# Altium schematic sheet Debug connector.SchDoc: Debug connector
size A4; Date: Not used; ApprovedBy: Not used; CheckedBy: Not used; Author: Not used; CompanyName: STMicroelectronics; DrawnBy: Not used; Engineer: Not used; Organization: Not used; Address1: Not used; Address2: Not used; Address3: Not used; Address4: Not used; DocumentNumber: Not used; Revision: Not used; SheetNumber: 18; SheetTotal: 22; CurrentTime: Not used; CurrentDate: Not used; Time: Not used; DocumentFullPathAndName: Not used; DocumentName: Not used; ModifiedDate: Not used; ImagePath: Not used; ProjectName: Not used; Application_BuildNumber: Not used
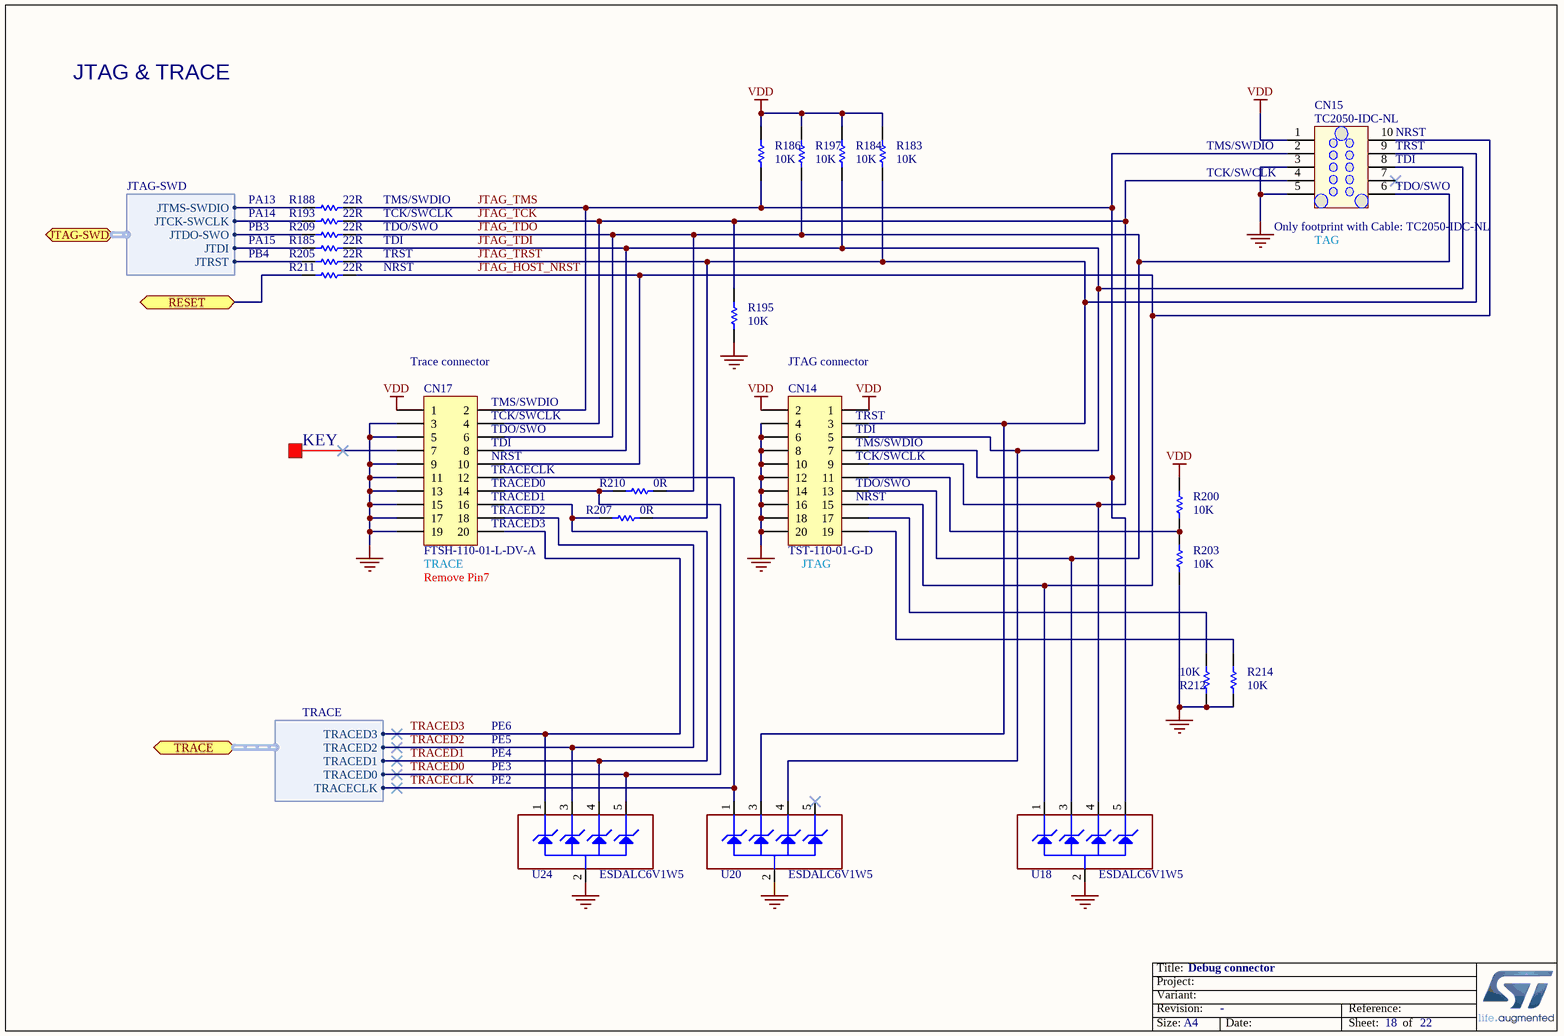
[diagram p0: Debug connector.SchDoc]

## Parts
CN14  value TST-110-01-G-D  [CON_CVILUX_CH87-20-2-V-1-00]  (hidden comment: Header 10x2)
CN15  value TC2050-IDC-NL  [CON_TAG-C_TC2050-IDC-NL]  (hidden comment: Tag-10-C)
CN17  value FTSH-110-01-L-DV-A  [CON_SAMTEC_FTSH-110-01-L-DV-A]  (hidden comment: Header 10x2)
R183  value 10K  [R0402]  (hidden comment: Resistor)
R184  value 10K  [R0402]  (hidden comment: Resistor)
R185  value 22R  [R0402]  (hidden comment: Resistor)
R186  value 10K  [R0402]  (hidden comment: Resistor)
R188  value 22R  [R0402]  (hidden comment: Resistor)
R193  value 22R  [R0402]  (hidden comment: Resistor)
R195  value 10K  [R0402]  (hidden comment: Resistor)
R197  value 10K  [R0402]  (hidden comment: Resistor)
R200  value 10K  [R0402]  (hidden comment: Resistor)
R203  value 10K  [R0402]  (hidden comment: Resistor)
R205  value 22R  [R0402]  (hidden comment: Resistor)
R207  value 0R  [R0402]  (hidden comment: Resistor)
R209  value 22R  [R0402]  (hidden comment: Resistor)
R210  value 0R  [R0402]  (hidden comment: Resistor)
R211  value 22R  [R0402]  (hidden comment: Resistor)
R212  value 10K  [R0402]  (hidden comment: Resistor)
R214  value 10K  [R0402]  (hidden comment: Resistor)
U18  ESDALC6V1W5  [ESD_SOT323-5L]
U20  ESDALC6V1W5  [ESD_SOT323-5L]
U24  ESDALC6V1W5  [ESD_SOT323-5L]

## Ports
JTAG-SWD (harness JTAG-SWD), RESET, TRACE (harness TRACE)

## Harnesses
TRACE: TRACECLK, TRACED0, TRACED1, TRACED2, TRACED3
JTAG-SWD: JTMS-SWDIO, JTCK-SWCLK, JTDI, JTDO-SWO, JTRST

## Nets
GND: CN14.4 CN14.6 CN14.8 CN14.10 CN14.12 CN14.14 CN14.16 CN14.18 CN14.20 CN15.3 CN15.5 CN17.3 CN17.5 CN17.9 CN17.11 CN17.13 CN17.15 CN17.17 CN17.19 R195.1 R203.1 R212.1 R214.1 U18.2(GND) U20.2(GND) U24.2(GND)
VDD: CN14.1 CN14.2 CN15.1 CN17.1 R183.2 R184.2 R186.2 R197.2 R200.2
JTAG_HOST_NRST: CN14.15 CN15.10 CN17.10 R211.1 U18.1(IO1)
JTAG_TCK: CN14.9 CN15.4 CN17.4 R193.1 R195.2 U18.4(IO3)
JTAG_TDI: CN14.5 CN15.8 CN17.8 R184.1 R185.1 U20.4(IO3)
JTAG_TDO: CN14.13 CN15.6 CN17.6 R197.1 R209.1 R210.2 U18.3(IO2)
JTAG_TMS: CN14.7 CN15.2 CN17.2 R186.1 R188.1 U18.5(IO4)
JTAG_TRST: CN14.3 CN15.9 R183.1 R205.1 R207.2 U20.3(IO2)
RESET: R211.2 ; port RESET
TRACECLK: CN17.12 U20.1(IO1) ; port TRACE.TRACECLK
TRACED0: CN17.14 R210.1 U24.5(IO4) ; port TRACE.TRACED0
TRACED1: CN17.16 R207.1 U24.4(IO3) ; port TRACE.TRACED1
TRACED2: CN17.18 U24.3(IO2) ; port TRACE.TRACED2
TRACED3: CN17.20 U24.1(IO1) ; port TRACE.TRACED3
NetCN14_11: CN14.11 R200.1 R203.2
NetCN14_17: CN14.17 R212.2
NetCN14_19: CN14.19 R214.2
NetR185_2: R185.2 ; port JTAG-SWD.JTDI
NetR188_2: R188.2 ; port JTAG-SWD.JTMS-SWDIO
NetR193_2: R193.2 ; port JTAG-SWD.JTCK-SWCLK
NetR205_2: R205.2 ; port JTAG-SWD.JTRST
NetR209_2: R209.2 ; port JTAG-SWD.JTDO-SWO

Not connected (* = marked no-connect by the designer): CN15 7*; CN17 7*; U20 5(IO4)*

## Notes on the sheet
- JTAG & TRACE
- (near CN15) TMS/SWDIO
- (near CN15) TCK/SWCLK
- (near CN15) TDI
- (near CN15) NRST
- (near CN15) TRST
- PA13
- PA14
- PB3
- PA15
- TMS/SWDIO
- TCK/SWCLK
- TDO/SWO
- TDI
- (near CN15) Only footprint with Cable: TC2050-IDC-NL
- (near CN15) TAG
- (near CN15) TDO/SWO
- PB4
- TRST
- NRST
- (near CN17) Trace connector
- JTAG connector
- KEY
- (near CN17) TMS/SWDIO
- (near CN17) TCK/SWCLK
- (near CN17) TDO/SWO
- (near CN17) TDI
- (near CN14) TRST
- (near CN14) TDI
- (near CN14) TMS/SWDIO
- (near CN17) NRST
- (near CN17) TRACECLK
- (near CN17) TRACED0
- (near CN17) TRACED1
- (near CN17) TRACED2
- (near CN14) TCK/SWCLK
- (near CN14) TDO/SWO
- (near CN14) NRST
- (near CN17) Remove Pin7
- (near CN17) TRACE
- (near CN17) TRACED3
- (near CN14) JTAG
- PE6
- PE5
- PE4
- PE3
- (near U24) PE2
- Title:
- Project:
- Size:
- Revision:
- Variant:
- A4
- -
- Date:
- Reference:
- Sheet:
- of

## Library data of the parts
CN14 = MCD-01058: Header, 2.54mm, 10x2, VR, TH, Height 9.1mm/3,1mm; Part_Type: Connector; Manufacturer: SAMTEC; Alternate_Manufacturer_Part_Number: CH87-20-2-V-1-00; Alternate_Manufacturer: CVILUX; Provided_By: SUBCO; Initial_Board_Reference: MB1331; Path: ws/MCD_ApplicationBoards/Lists/MCDPARTSdatabase; Item Type: Item; Internal_Part_Number: MCD-01058; Status: Released; Manufacturer_Part_Number: TST-110-01-G-D; ComponentLink1Description: Datasheet; ComponentLink1URL: http://tunmcdsvn.tun.st.com/Component_Datasheet_Library/Trunk/Connectors/Samtec_TST-series/
CN15 = MCD-00031: Tag_Connector Header, 10x2, No legs; Manufacturer_Part_Number: TC2050-IDC-NL-FP; Manufacturer: TAG-CONNECT LLC; Provided_By: SUBCO; Initial_Board_Reference: MB1274; Path: ws/MCD_ApplicationBoards/Lists/MCDPARTSdatabase; Item Type: Item; Internal_Part_Number: MCD-00031; Status: Released; Part_Type: Connector; ComponentLink1Description: Datasheet; ComponentLink1URL: http://tunmcdsvn.tun.st.com/Component_Datasheet_Library/Trunk/Connectors/TAG_Connector_TC2050-IDC-NLFP
CN17 = MCD-01561: Header 10x2, 1.27mm, VR, CMS, Height 3.05mm with alignment pin; Part_Type: Connector; Manufacturer: SAMTEC; Provided_By: SUBCO; Initial_Board_Reference: MB1397; Path: ws/MCD_ApplicationBoards/Lists/MCDPARTSdatabase; Item Type: Item; Remark: new part FTSH-110-01-L-DV-A to replace MCD-00557 footprint; Internal_Part_Number: MCD-01561; Status: New; Manufacturer_Part_Number: FTSH-110-01-L-DV-A; ComponentLink1Description: Datasheet; ComponentLink1URL: http://tunmcdsvn.tun.st.com/Component_Datasheet_Library/Trunk/Connectors/Samtec_FTSH_smt_series
R183 R184 R186 R195 R197 R200 R203 R212 R214 = MCD-00053: Resistor,10K,0402,1%,1/16W; Manufacturer_Part_Number: RC0402FR-0710KL; Manufacturer: YAGEO; Provided_By: SUBCO; Initial_Board_Reference: MB1274; Path: ws/MCD_ApplicationBoards/Lists/MCDPARTSdatabase; Item Type: Item; Internal_Part_Number: MCD-00053; ComponentLink1Description: Datasheet; Status: Released; Part_Type: Resistor; Package: R0402; ComponentLink1URL: http://tunmcdsvn.tun.st.com/Component_Datasheet_Library/Trunk/Resistors/Yageo_Resistor_RC0402-series
R185 R188 R193 R205 R209 R211 = MCD-00189: Resistor,22R,0402,1%,1/16W; Manufacturer_Part_Number: RC0402FR-0722RL; Manufacturer: YAGEO; Provided_By: SUBCO; Initial_Board_Reference: MBxxxx; Path: ws/MCD_ApplicationBoards/Lists/MCDPARTSdatabase; Item Type: Item; Internal_Part_Number: MCD-00189; ComponentLink1Description: Datasheet; Status: Released; Part_Type: Resistor; Package: R0402; ComponentLink1URL: http://tunmcdsvn.tun.st.com/Component_Datasheet_Library/Trunk/Resistors/Yageo_Resistor_RC0402-series
R207 R210 = MCD-00052: Resistor,0R,0402,5%,1/16W; Manufacturer_Part_Number: RC0402JR-070RL; Manufacturer: YAGEO; Provided_By: SUBCO; Initial_Board_Reference: MB1274; Path: ws/MCD_ApplicationBoards/Lists/MCDPARTSdatabase; Item Type: Item; Internal_Part_Number: MCD-00052; Status: Released; Part_Type: Resistor; Package: R0402; ComponentLink1Description: Datasheet; ComponentLink1URL: http://tunmcdsvn.tun.st.com/Component_Datasheet_Library/Trunk/Resistors/Yageo_Resistor_RC0402-series
U18 U20 U24 = MCD-00136: Dual Transil array for ESD protection; Manufacturer: STMICROELECTRONICS; Part_Type: Diode; BMS_Part_Number: 9151112; Provided_By: SUBCO with ST control; Initial_Board_Reference: MB1262; Path: ws/MCD_ApplicationBoards/Lists/MCDPARTSdatabase; Item Type: Item; Internal_Part_Number: MCD-00136; Value: ESDALC6V1W5; Manufacturer_Part_Number: ESDALC6V1W5; ComponentLink1Description: Datasheet; Status: Released; ComponentLink1URL: http://tunmcdsvn.tun.st.com/Component_Datasheet_Library/Trunk/Diodes/STM_ESD_ESDALC6V1W5